# Altium schematic sheet mux6-1(3wires).SchDoc
size A2
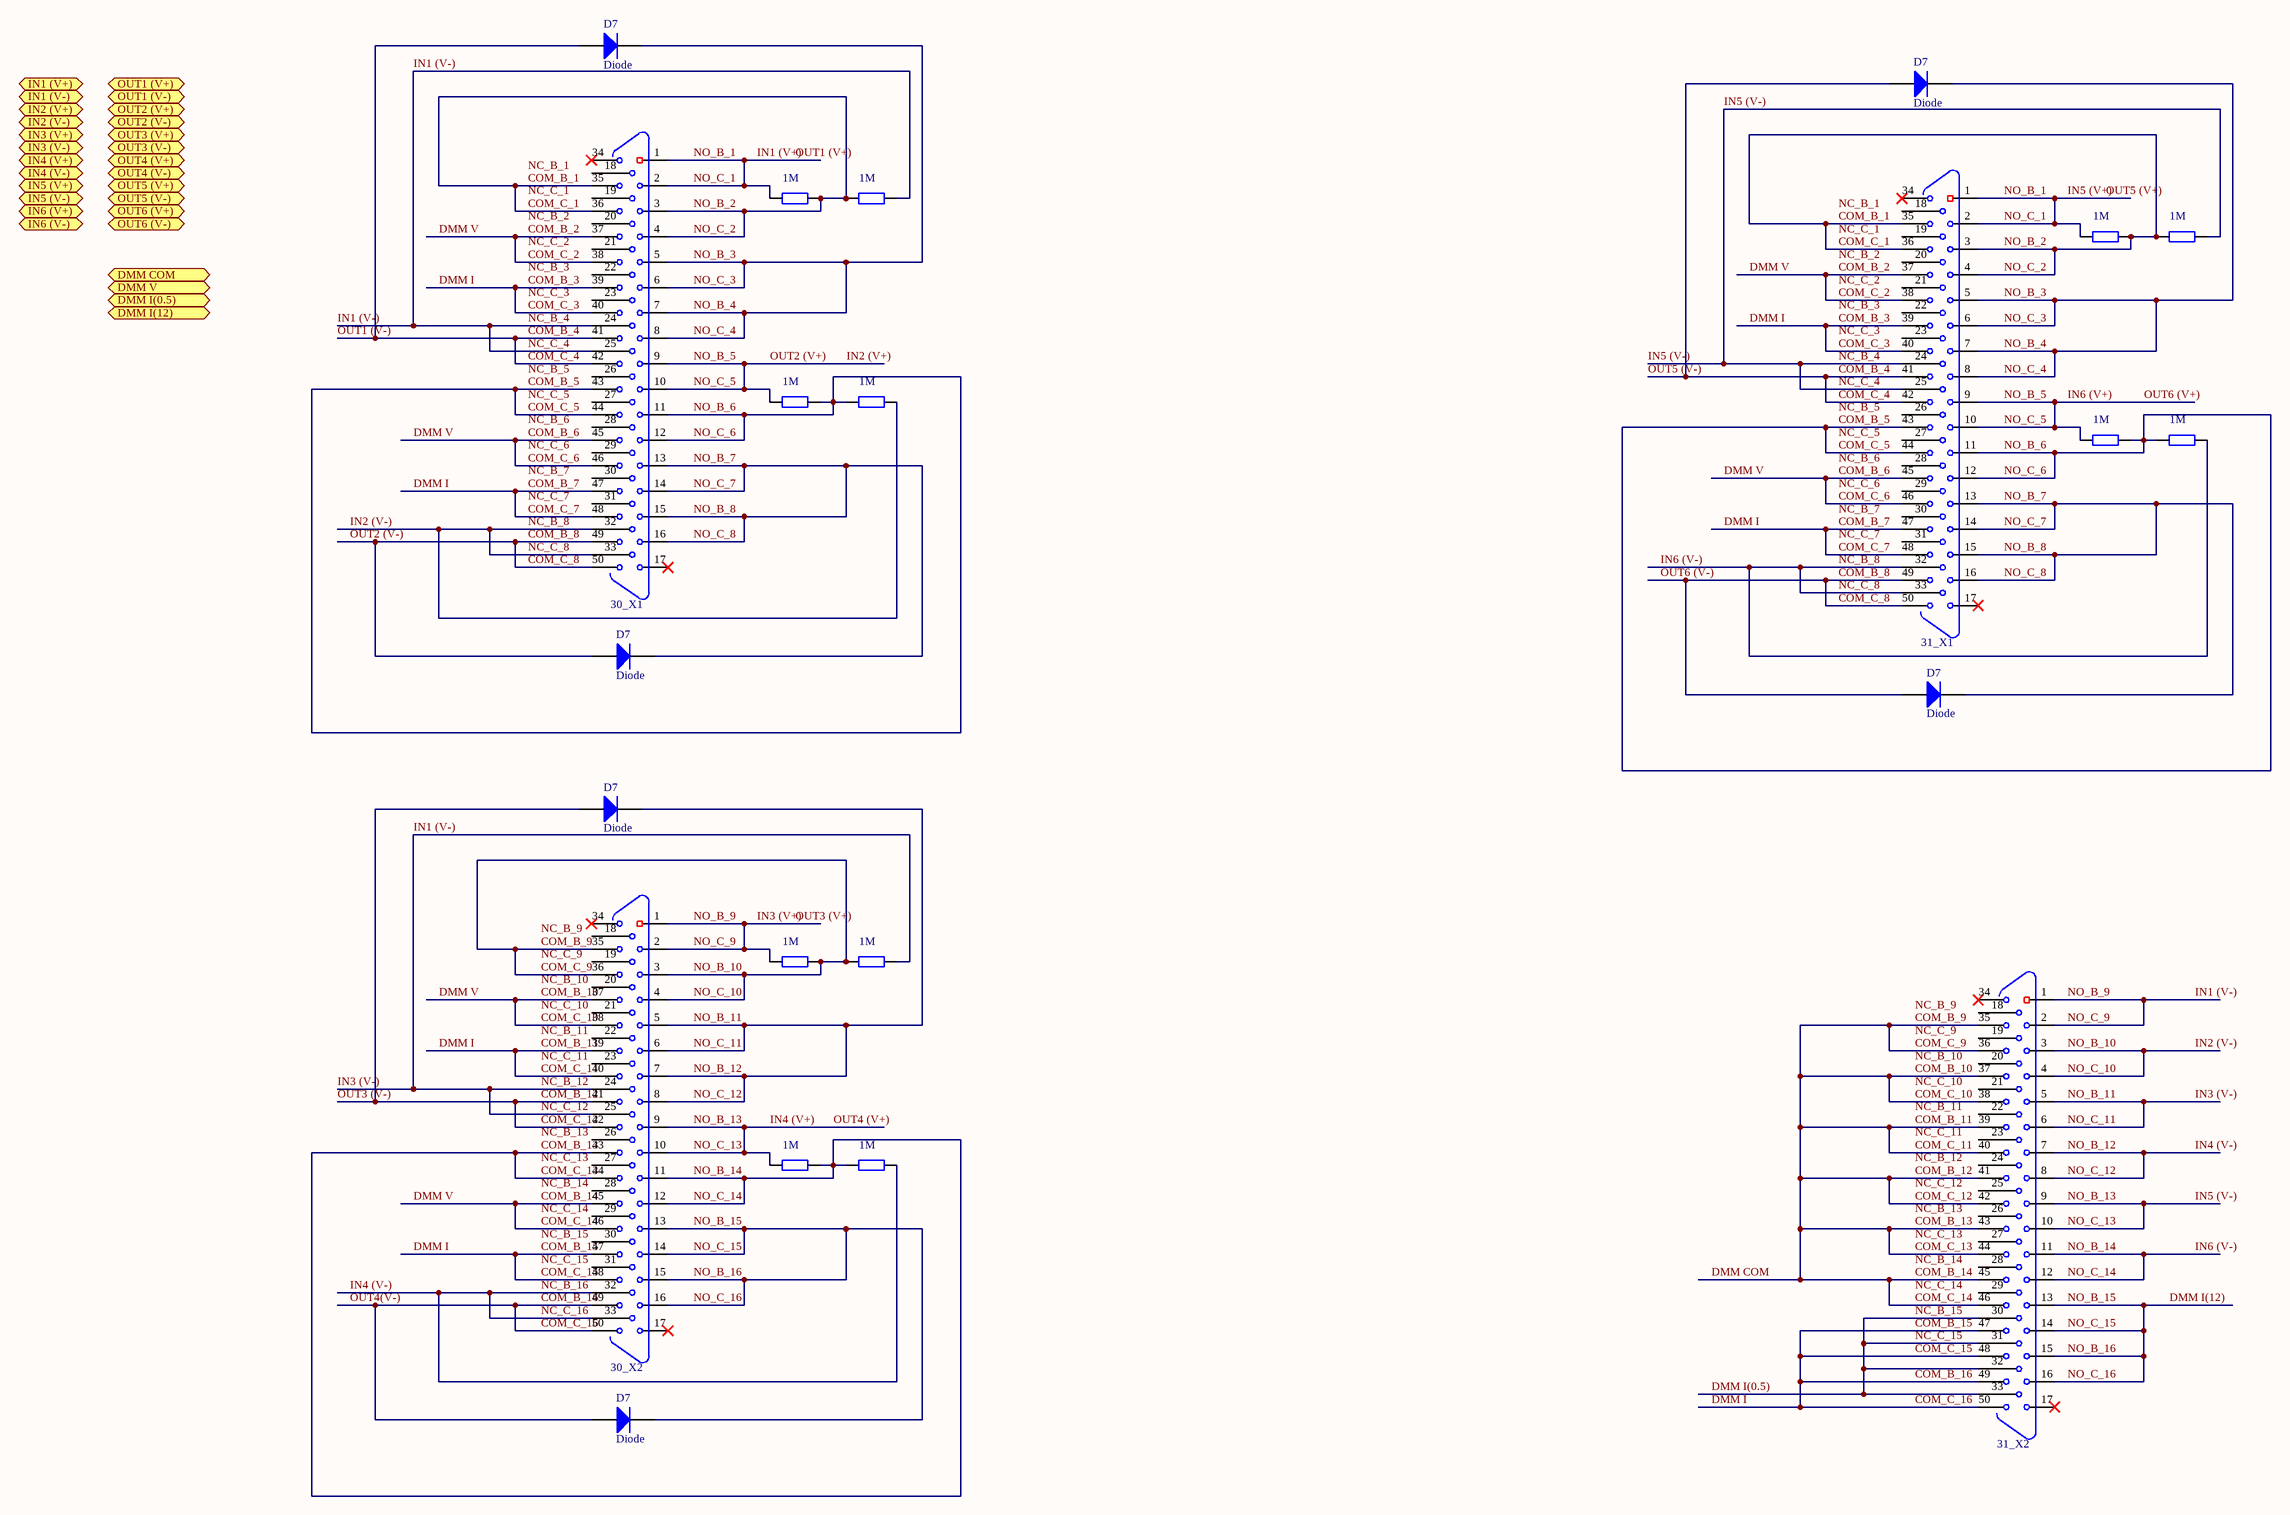
[diagram p0: mux6-1(3wires).SchDoc]

## Parts
(Parts that share a designator on the sheet are numbered #1, #2 ... from top to bottom, then left to right.)
30_X1  DB50  [DB50_RA]  (value not drawn)
30_X2  DB50  [DB50_RA]  (value not drawn)
31_X1  DB50  [DB50_RA]  (value not drawn)
31_X2  DB50  [DB50_RA]  (value not drawn)
D7#1  Diode  [DSO-C2/X3.3]
D7#2  Diode  [DSO-C2/X3.3]
D7#3  Diode  [DSO-C2/X3.3]
D7#4  Diode  [DSO-C2/X3.3]
D7#5  Diode  [DSO-C2/X3.3]
D7#6  Diode  [DSO-C2/X3.3]
R1#1  value 1M  [AXIAL-0.4]  (hidden comment: Res2)
R1#2  value 1M  [AXIAL-0.4]  (hidden comment: Res2)
R1#3  value 1M  [AXIAL-0.4]  (hidden comment: Res2)
R1#4  value 1M  [AXIAL-0.4]  (hidden comment: Res2)
R1#5  value 1M  [AXIAL-0.4]  (hidden comment: Res2)
R1#6  value 1M  [AXIAL-0.4]  (hidden comment: Res2)
R2#1  value 1M  [AXIAL-0.4]  (hidden comment: Res2)
R2#2  value 1M  [AXIAL-0.4]  (hidden comment: Res2)
R2#3  value 1M  [AXIAL-0.4]  (hidden comment: Res2)
R2#4  value 1M  [AXIAL-0.4]  (hidden comment: Res2)
R2#5  value 1M  [AXIAL-0.4]  (hidden comment: Res2)
R2#6  value 1M  [AXIAL-0.4]  (hidden comment: Res2)

## Ports
DMM COM (out), DMM I(0.5) (out), DMM I(12) (out), DMM V (out), IN1 (V+) (in), IN1 (V-) (in), IN2 (V+) (in), IN2 (V-) (in), IN3 (V+) (in), IN3 (V-) (in), IN4 (V+) (in), IN4 (V-) (in), IN5 (V+) (in), IN5 (V-) (in), IN6 (V+) (in), IN6 (V-) (in), OUT1 (V+) (out), OUT1 (V-) (out), OUT2 (V+) (out), OUT2 (V-) (out), OUT3 (V+) (out), OUT3 (V-) (out), OUT4 (V+) (out), OUT4 (V-) (out), OUT5 (V+) (out), OUT5 (V-) (out), OUT6 (V+) (out), OUT6 (V-) (out)

## Nets
COM_B_1: 30_X1.3 30_X1.4 30_X1.35 30_X1.36 31_X1.3 31_X1.4 31_X1.35 31_X1.36 R1#1.2 R1#2.2 R2#1.1 R2#2.1  [also labelled COM_C_1, NO_B_2, NO_C_2]
COM_B_4: 30_X1.41 30_X1.42 31_X1.41 31_X1.42 D7#1.1(A) D7#2.1(A)  [also labelled COM_C_4, OUT1 (V-), OUT5 (V-)]
COM_B_5: 30_X1.11 30_X1.12 30_X1.43 30_X1.44 31_X1.11 31_X1.12 31_X1.43 31_X1.44 R1#3.2 R1#4.2 R2#3.1 R2#4.1  [also labelled COM_C_5, NO_B_6, NO_C_6]
COM_B_8: 30_X1.49 30_X1.50 31_X1.49 31_X1.50 D7#3.1(A) D7#4.1(A)  [also labelled COM_C_8, OUT2 (V-), OUT6 (V-)]
COM_B_10: 30_X1.32 30_X1.33 30_X1.37 30_X1.38 30_X1.39 30_X1.40 30_X1.45 30_X1.46 30_X1.47 30_X1.48 30_X2.3 30_X2.4 30_X2.11 30_X2.12 30_X2.35 30_X2.36 30_X2.37 30_X2.38 30_X2.39 30_X2.40 30_X2.41 30_X2.42 30_X2.43 30_X2.44 30_X2.45 30_X2.46 30_X2.47 30_X2.48 30_X2.49 30_X2.50 31_X1.32 31_X1.33 31_X1.37 31_X1.38 31_X1.39 31_X1.40 31_X1.45 31_X1.46 31_X1.47 31_X1.48 31_X2.3 31_X2.4 31_X2.11 31_X2.12 31_X2.35 31_X2.36 31_X2.37 31_X2.38 31_X2.39 31_X2.40 31_X2.41 31_X2.42 31_X2.43 31_X2.44 31_X2.45 31_X2.46 31_X2.47 31_X2.48 31_X2.49 31_X2.50 D7#5.1(A) D7#6.1(A) R1#5.2 R1#6.2 R2#3.2 R2#4.2 R2#5.1 R2#6.1  [also labelled COM_B_11, COM_B_12, COM_B_13, COM_B_14, COM_B_15, COM_B_16, COM_B_2, COM_B_3, COM_B_6, COM_B_7, COM_B_9, COM_C_10, COM_C_11, COM_C_12, COM_C_13, COM_C_14, COM_C_15, COM_C_16, COM_C_2, COM_C_3, COM_C_6, COM_C_7, COM_C_9, DMM COM, DMM I, DMM V, IN2 (V-), IN6 (V-), NC_B_8, NC_C_8, NO_B_10, NO_B_14, NO_C_10, NO_C_14, OUT3 (V-), OUT4(V-)]
DMM I(0.5): 31_X2.30 31_X2.31 31_X2.32 31_X2.33  [also labelled NC_B_15, NC_C_15]
DMM I(12): 30_X2.13 30_X2.14 30_X2.15 30_X2.16 31_X2.13 31_X2.14 31_X2.15 31_X2.16 D7#6.2(K)  [also labelled NO_B_15, NO_B_16, NO_C_15, NO_C_16]
IN1 (V+): 30_X1.1 30_X1.2 31_X1.1 31_X1.2 R1#1.1 R1#2.1  [also labelled IN5 (V+), NO_B_1, NO_C_1, OUT1 (V+), OUT5 (V+)]
IN1 (V-): 30_X1.24 30_X1.25 30_X2.1 30_X2.2 30_X2.5 30_X2.6 30_X2.7 30_X2.8 30_X2.9 30_X2.10 30_X2.24 30_X2.25 30_X2.32 30_X2.33 31_X1.24 31_X1.25 31_X2.1 31_X2.2 31_X2.5 31_X2.6 31_X2.7 31_X2.8 31_X2.9 31_X2.10 D7#5.2(K) R1#5.1 R1#6.1 R2#1.2 R2#2.2 R2#5.2 R2#6.2  [also labelled IN3 (V+), IN3 (V-), IN4 (V+), IN4 (V-), IN5 (V-), NC_B_12, NC_B_16, NC_B_4, NC_C_12, NC_C_16, NC_C_4, NO_B_11, NO_B_12, NO_B_13, NO_B_9, NO_C_11, NO_C_12, NO_C_13, NO_C_9, OUT3 (V+), OUT4 (V+)]
IN2 (V+): 30_X1.9 30_X1.10 31_X1.9 31_X1.10 R1#3.1 R1#4.1  [also labelled IN6 (V+), NO_B_5, NO_C_5, OUT2 (V+), OUT6 (V+)]
NO_B_3: 30_X1.5 30_X1.6 30_X1.7 30_X1.8 31_X1.5 31_X1.6 31_X1.7 31_X1.8 D7#1.2(K) D7#2.2(K)  [also labelled NO_B_4, NO_C_3, NO_C_4]
NO_B_7: 30_X1.13 30_X1.14 30_X1.15 30_X1.16 31_X1.13 31_X1.14 31_X1.15 31_X1.16 D7#3.2(K) D7#4.2(K)  [also labelled NO_B_8, NO_C_7, NO_C_8]

Not connected (* = marked no-connect by the designer): 30_X1 17* 18 19 20 21 22 23 26 27 28 29 30 31 34*; 30_X2 17* 18 19 20 21 22 23 26 27 28 29 30 31 34*; 31_X1 17* 18 19 20 21 22 23 26 27 28 29 30 31 34*; 31_X2 17* 18 19 20 21 22 23 24(7) 25(3) 26 27 28 29 34*

## Notes on the sheet
- Labels drawn without touching a wire or pin: NC_B_1, NC_B_2, NC_B_3, NC_B_5, NC_B_6, NC_B_7, NC_B_9, NC_B_10, NC_B_11, NC_B_12, NC_B_13, NC_B_14, NC_B_15, NC_C_1, NC_C_2, NC_C_3, NC_C_5, NC_C_6, NC_C_7, NC_C_9, NC_C_10, NC_C_11, NC_C_12, NC_C_13, NC_C_14, NC_C_15

## Library data of the parts
D7#1-D7#6 = Diode: Default Diode; Published: 8-Jun-2000; LatestRevisionDate: 17-Jul-2002; LatestRevisionNote: Re-released for DXP Platform.; PackageVersion: Sep-1996; PackageReference: SMC; Publisher: Altium Limited; Code_JEDEC: DO-214-AB
R1#1-R1#6 R2#1-R2#6 = Res2: Resistor; Published: 8-Jun-2000; LatestRevisionDate: 17-Jul-2002; LatestRevisionNote: Re-released for DXP Platform.; PackageReference: AXIAL-0.4; Publisher: Altium Limited